# Altium schematic sheet GSM_INDICATION.SchDoc: Title
size A4; Date: *******; ApprovedBy: *******; CheckedBy: None; Author: *******; CompanyName: *******; DrawnBy: Name; Engineer: *******; Organization: *******; Address1: *******; Address2: *******; Address3: *******; Address4: *******; DocumentNumber: 3; Revision: *******; SheetNumber: 4; SheetTotal: 9; CurrentTime: *******; CurrentDate: *******; Time: *******; DocumentFullPathAndName: *******; DocumentName: *******; ModifiedDate: *******; ImagePath: *******; ProjectName: *******; Application_BuildNumber: *******
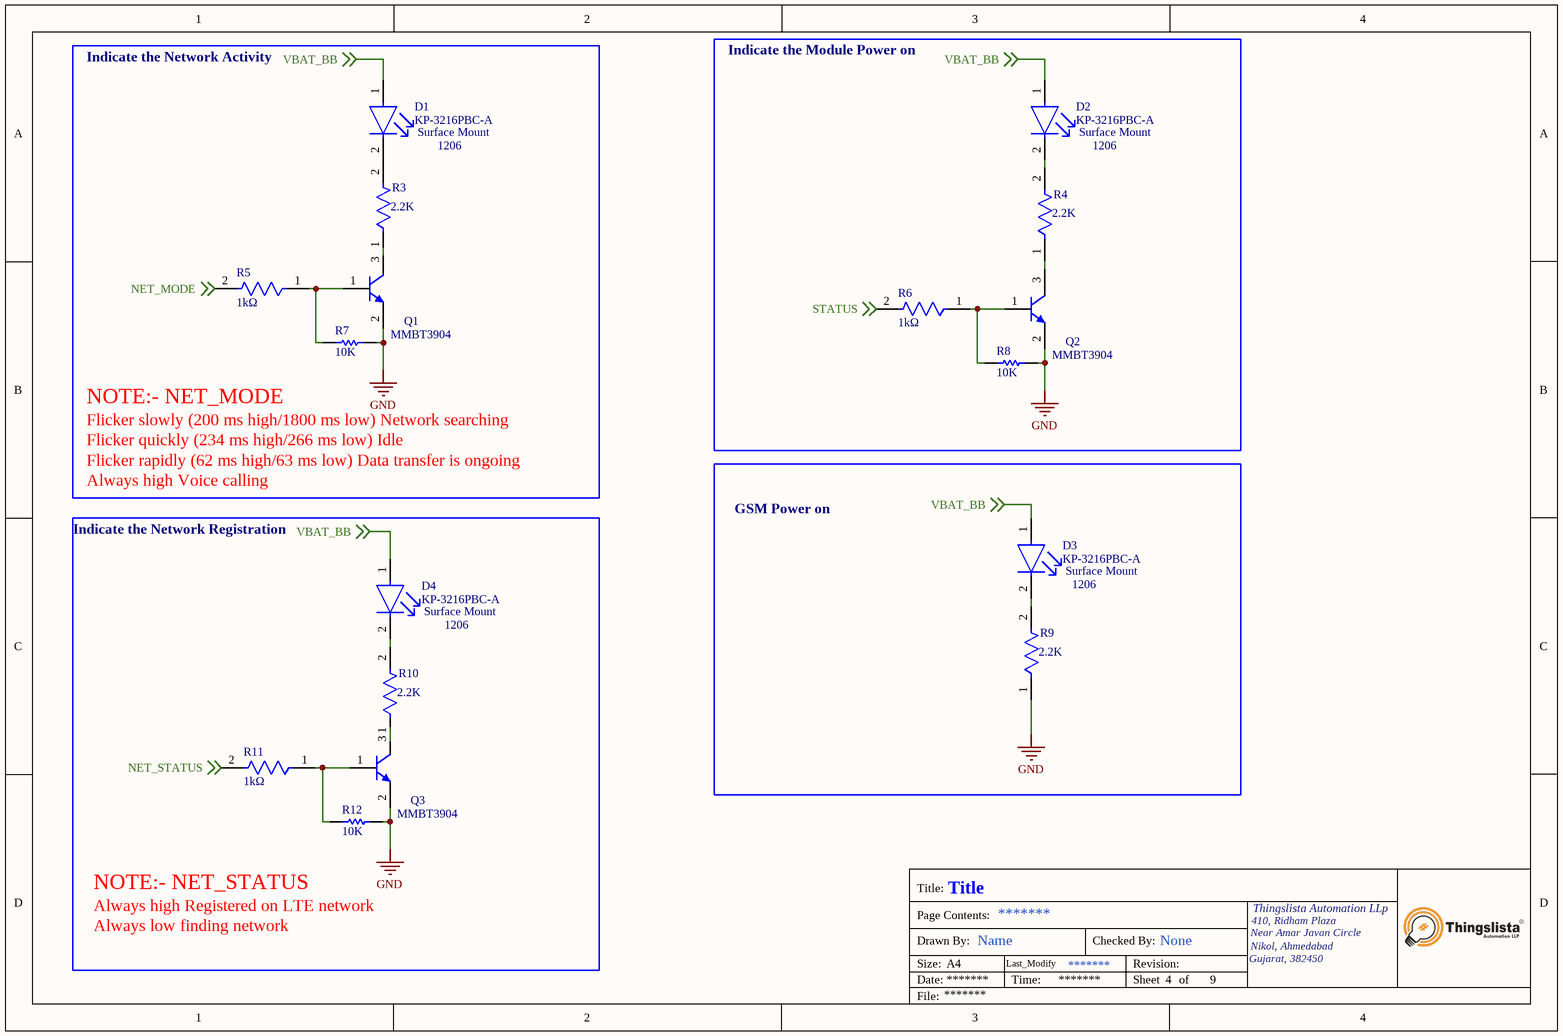
[diagram p0: GSM_INDICATION.SchDoc]

## Parts
D1  KP-3216PBC-A  Series: 1206  Mount: Surface Mount  [FP-KP-3216PBC-A-MFG]
D2  KP-3216PBC-A  Series: 1206  Mount: Surface Mount  [FP-KP-3216PBC-A-MFG]
D3  KP-3216PBC-A  Series: 1206  Mount: Surface Mount  [FP-KP-3216PBC-A-MFG]
D4  KP-3216PBC-A  Series: 1206  Mount: Surface Mount  [FP-KP-3216PBC-A-MFG]
Q1  MMBT3904  [FAIR-SOT23-3_V]
Q2  MMBT3904  [FAIR-SOT23-3_V]
Q3  MMBT3904  [FAIR-SOT23-3_V]
R3  Resistance: 2.2K  [FP-CRCW0805-e3-IPC_B]  (hidden comment: CRCW08052K20FKEA)
R4  Resistance: 2.2K  [FP-CRCW0805-e3-IPC_B]  (hidden comment: CRCW08052K20FKEA)
R5  Resistance: 1kΩ  [FP-CRG0805-IPC_A]  (hidden comment: CRG0805F1K0)
R6  Resistance: 1kΩ  [FP-CRG0805-IPC_A]  (hidden comment: CRG0805F1K0)
R7  value 10K  [RESC2013X60X35NL10T20]  (hidden comment: RC0805FR-0710KL)
R8  value 10K  [RESC2013X60X35NL10T20]  (hidden comment: RC0805FR-0710KL)
R9  Resistance: 2.2K  [FP-CRCW0805-e3-IPC_B]  (hidden comment: CRCW08052K20FKEA)
R10  Resistance: 2.2K  [FP-CRCW0805-e3-IPC_B]  (hidden comment: CRCW08052K20FKEA)
R11  Resistance: 1kΩ  [FP-CRG0805-IPC_A]  (hidden comment: CRG0805F1K0)
R12  value 10K  [RESC2013X60X35NL10T20]  (hidden comment: RC0805FR-0710KL)

## Blocks framed on the sheet
NOTE:- NET_MODE: D1 Q1 R3 R5 R7
Indicate the Module Power on: D2 Q2 R4 R6 R8
NOTE:- NET_STATUS: D4 Q3 R10-R12
GSM Power on: D3 R9

## Nets
GND: Q1.2(E) Q2.2(E) Q3.2(E) R7.1 R8.1 R9.1 R12.1
NET_MODE: R5.2 ; off-sheet NET_MODE
NET_STATUS: R11.2 ; off-sheet NET_STATUS
STATUS: R6.2 ; off-sheet STATUS
VBAT_BB: D1.1(A) D2.1(A) D3.1(A) D4.1(A) ; off-sheet VBAT_BB
NetD1_2: D1.2(C) R3.2
NetD2_2: D2.2(C) R4.2
NetD3_2: D3.2(C) R9.2
NetD4_2: D4.2(C) R10.2
NetQ1_1: Q1.1(B) R5.1 R7.2
NetQ1_3: Q1.3(C) R3.1
NetQ2_1: Q2.1(B) R6.1 R8.2
NetQ2_3: Q2.3(C) R4.1
NetQ3_1: Q3.1(B) R11.1 R12.2
NetQ3_3: Q3.3(C) R10.1

## Notes on the sheet
- Indicate the Network Activity
- Flicker slowly (200 ms high/1800 ms low) Network searching
- Flicker quickly (234 ms high/266 ms low) Idle
- Flicker rapidly (62 ms high/63 ms low) Data transfer is ongoing
- Always high Voice calling
- Indicate the Network Registration
- Always high Registered on LTE network
- Always low finding network
- Title:
- Page Contents:
- 410, Ridham Plaza
- Thingslista Automation LLp
- Size:
- Date:
- File:
- Drawn By:
- A4
- Last_Modify
- Time:
- Checked By:
- Revision:
- Sheet
- of
- Gujarat, 382450
- Near Amar Javan Circle
- Nikol, Ahmedabad

## Library data of the parts
D1-D4 = CMP-44529-000052-1: LED, Low Power, Blue, SMD, 1.6mm x 2mm, 20 mA, 3.2 V, 470 nm; Forward Voltage: 3.2V; Wavelength: 470nm; Luminous Intensity: 60mcd; Lens Color: Clear; Forward Current: 20mA; Viewing Angle: 120°; Number of LEDs: 1; Lens Style: Rectangular; Color: Blue; Case/Package: 3216; Dominant Wavelength: 470nm; RoHS Compliant: No; Packaging: Cut Tape; Number of Pins: 2; REACH SVHC: No SVHC
Q1-Q3 = CMP-1670-00008-1: NPN General Purpose Amplifier, 40 V, 0.2 A, -55 to 150 degC, 3-Pin SOT23, RoHS, Tape and Reel; Tolerance: 30ppm; Capacitance: 1.8E-11 f; Frequency: 12.288 MHz; ESR: 40 Ohm; Load Capacitance: 18 pF; REACH SVHC: No SVHC; Pins: 4; ComponentLink3URL: http://www.fairchildsemi.com/dwg/MA/MA03D.pdf; PackageDescription: 3-Pin Small Outline Transistor, Body 2.92 x 1.325 mm, Pitch 0.95 mm; ComponentLink1URL: https://www.fairchildsemi.com/; Max Operating Temperature: 70degC; PackageReference: SOT23-3; ComponentLink1Description: Manufacturer URL; Width: 0.126 inch; Min Operating Temperature: -20degC; DatasheetVersion: Rev. 1.1.0, 10/2014; Mount: Surface Mount; Height: 0.041 inch; Package Quantity: 1000; Frequency Tolerance: 30ppm; Packaging: Tape and Reel; ComponentLink2URL: https://www.fairchildsemi.com/datasheets/MM/MMBT3904.pdf; RoHSCompliant: True; ComponentLink3Description: Package Specification; ComponentLink2Description: Datasheet; Length: 0.197 inch
R3 R4 R9 R10 = CMP-2001-03760-2: RES Thick Film, 2.2kΩ, 1%, 0.125W, 100ppm/°C, 0805; Voltage Rating (DC): 150V; Max Power Dissipation: 125mW; Case/Package: 0805; Width: 1.25mm; Voltage Rating: 150V; Composition: Thick Film; Power Rating: 125mW; Packaging: Tape and Reel; Min Operating Temperature: -55°C; Contact Plating: Tin; Tolerance: 1%; Military Standard: Not; Case Code (Metric): 2012; Radiation Hardening: No; Termination: SMD/SMT; Lead Free: Lead Free; Case Code (Imperial): 0805; Max Operating Temperature: 155°C; Depth: 1.25mm; Weight: 0.000194oz; Number of Terminations: 2; Length: 2mm; Package Quantity: 10; Temperature Coefficient: 100ppm/°C; Features: Automotive AEC-Q200; Height: 0.45mm
R5 R6 R11 = CMP-03790-16077480-1: CRG0805F1K0 Thick Film Resistors - SMD 1K Ohm 1% 1/8W Res Thick Film 0805; Manufacturer Lifecycle Status: ACTIVE; Max Power Dissipation: 125mW; Voltage Rating: 150V; Number of Resistors: 1; Temperature Coefficient: 100ppm/°C; ELV: Compliant; Case/Package: 0805; Number of Terminations: 2; Termination: SMD/SMT, Solder; Composition: Thick Film; Voltage Rating (DC): 150V; Min Operating Temperature: -55°C; Tolerance: 1%; Case Code (Imperial): 0805; Power Rating: 125mW; Schedule B: 8533210045, 8533210090, 8533210090; Case Code (Metric): 2012; NexarPartId: 16077480; Packaging: Tape and Reel; Lifecycle Status: Production; Depth: 1.25mm; Mount: Surface Mount; Weight: 5.499807mg; Radiation Hardening: No; Max Operating Temperature: 125°C; Width: 1.2446mm; Length: 2mm; Military Standard: Not; RoHS: Compliant; Height: 550µm
R7 R8 R12 = CMP-1659-00013-4: Chip Resistor, 10 KOhm, +/- 1%, 0.125 W, -55 to 155 degC, 0805 (2012 Metric), RoHS, Tape and Reel; Manufacturer: Yageo; Voltage Rating: 150 V; Mount: Surface Mount; ComponentLink1Description: Manufacturer URL; ComponentLink2URL: http://www.yageo.com/documents/recent/PYu-RC_Group_51_RoHS_L_04.pdf; Pins: 2; Length: 2 mm; Min Operating Temperature: -55 degC; Height: 0.5 mm; Mounting Technology: Surface Mount; RoHSCompliant: true; REACH SVHC: No SVHC; ComponentLink1URL: http://www.yageo.com/; Max Operating Temperature: 155 degC; PackageReference: 0805; DatasheetVersion: Rev. 4, 02/2016; Package Quantity: 5000; Packaging: Tape and Reel; ComponentLink2Description: Datasheet; PackageDescription: 2-Pin Surface Mounted Device, Body 2 x 1.25 mm